# Altium project EMI_Probe.PrjPcb
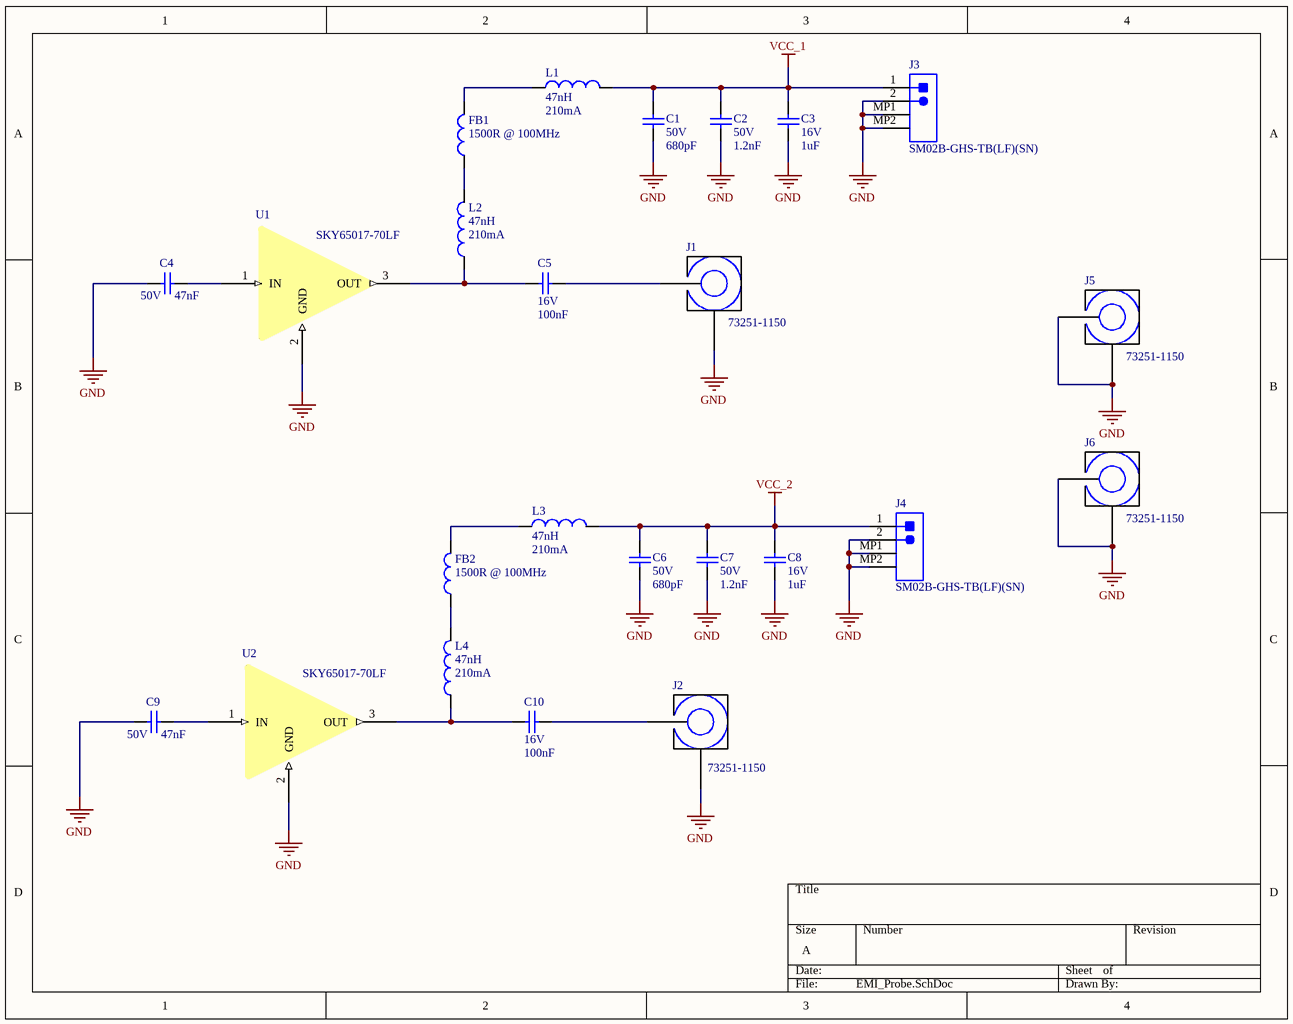
[diagram p0: EMI_Probe.SchDoc]
1 sheet, 24 parts. Net scope: global (net labels, ports and power ports of the same name join across sheets).
Board file: PCB1.PcbDoc

## Sheet EMI_Probe.SchDoc
size A

### Parts
C1  Voltage: 50V  [C0402[1005]]  (hidden comment: 680pF)
C2  Voltage: 50V  [C0603[1608]]  (hidden comment: 1.2nF)
C3  Voltage: 16V  [C0402[1005]]  (hidden comment: 1uF)
C4  Voltage: 50V  [C0402[1005]]  (hidden comment: 47nF)
C5  Voltage: 16V  [C0402[1005]]  (hidden comment: 100nF)
C6  Voltage: 50V  [C0402[1005]]  (hidden comment: 680pF)
C7  Voltage: 50V  [C0603[1608]]  (hidden comment: 1.2nF)
C8  Voltage: 16V  [C0402[1005]]  (hidden comment: 1uF)
C9  Voltage: 50V  [C0402[1005]]  (hidden comment: 47nF)
C10  Voltage: 16V  [C0402[1005]]  (hidden comment: 100nF)
FB1  1500R @ 100MHz  [R0805[2012]]
FB2  1500R @ 100MHz  [R0805[2012]]
J1  73251-1150  [732511040]
J2  73251-1150  [732511040]
J3  SM02B-GHS-TB(LF)(SN)  [SM02B-GHS-TB]
J4  SM02B-GHS-TB(LF)(SN)  [SM02B-GHS-TB]
J5  73251-1150  [732511040]
J6  73251-1150  [732511040]
L1  47nH  Current Rating: 210mA  [C0402[1005]]
L2  47nH  Current Rating: 210mA  [C0402[1005]]
L3  47nH  Current Rating: 210mA  [C0402[1005]]
L4  47nH  Current Rating: 210mA  [C0402[1005]]
U1  SKY65017-70LF  [SOT-89]
U2  SKY65017-70LF  [SOT-89]

### Nets
GND: C1.1 C2.1 C3.1 C4.2 C6.1 C7.1 C8.1 C9.2 J1.2 J2.2 J3.2 J3.MP1 J3.MP2 J4.2 J4.MP1 J4.MP2 J5.1 J5.2 J6.1 J6.2 U1.2(GND) U2.2(GND)
VCC_1: C1.2 C2.2 C3.2 J3.1 L1.2
VCC_2: C6.2 C7.2 C8.2 J4.1 L3.2
NetC4_1: C4.1 U1.1(IN)
NetC5_1: C5.1 J1.1
NetC5_2: C5.2 L2.1 U1.3(OUT)
NetC9_1: C9.1 U2.1(IN)
NetC10_1: C10.1 J2.1
NetC10_2: C10.2 L4.1 U2.3(OUT)
NetFB1_1: FB1.1 L2.2
NetFB1_2: FB1.2 L1.1
NetFB2_1: FB2.1 L4.2
NetFB2_2: FB2.2 L3.1

### Library data of the parts
C1 C6 = C680pF 50V 0402: 680pF 50V X7R 10% 0402; Manufacturer: Yageo; Manufacturer Part Number: CC0402KRX7R9BB681; Internal Code: 0-ECCAP680pX7RV50%10P0402-YG; Type: Capacitor; Package: 0402; Supplier1: DigiKey; Supplier Part Number1: 311-1030-2-ND; Supplier Link1: https://www.digikey.fr/product-detail/fr/yageo/CC0402KRX7R9BB681/311-1030-2-ND/302764; Datasheet: http://www.yageo.com/documents/recent/UPY-GPHC_X7R_6.3V-to-50V_18.pdf; Tolerance: 10%; Temp Coef: X7R; Value: 680pF
C2 C7 = C1.2nF 50V 0603: 1.2nF 50V C0G,NP0 5% 0603; Manufacturer: Walsin; Manufacturer Part Number: 0603N122J500CT; Internal Code: 0-ECCAP1n2NP0V50%05P0603-WS; Temp Coef: C0G NP0; Type: Capacitor; Package: 0603; Supplier1: DigiKey; Supplier Part Number1: 1292-1482-6-ND; Supplier Link1: https://www.digikey.fr/product-detail/fr/walsin-technology-corporation/0603N122J500CT/1292-1482-6-ND/9356021; Datasheet: http://www.passivecomponent.com/wp-content/uploads/2018/10/MLCC.pdf; Tolerance: 5%; Value: 1.2nF
C3 C8 = C1uF 16V 0402: 1uF 16V X5R 10% 0402; Manufacturer: Samsung Electro-Mechanics; Manufacturer Part Number: CL05A105KO5NNNC; Internal Code: 0-ECCAP1uX5RV16%10P0402-; Type: Capacitor; Package: 0402; Supplier1: DigiKey; Supplier Part Number1: 1276-1067-2-ND; Supplier Link1: https://www.digikey.fr/product-detail/fr/samsung-electro-mechanics/CL05A105KO5NNNC/1276-1067-2-ND/3886725; Datasheet: http://www.samsungsem.com/kr/support/product-search/mlcc/CL05A105KO5NNNC.jsp; Tolerance: 10%; Temp Coef: X5R; Value: 1uF
C4 C9 = C47nF 50V 0402: 47nF 50V X7R 10% 0402; Manufacturer: Yageo; Manufacturer Part Number: CC0402KRX7R9BB473; Internal Code: 0-ECCAP47nX7RV50%10P0402-YG; Type: Capacitor; Package: 0402; Supplier1: DigiKey; Supplier Part Number1: 311-3815-1-ND; Supplier Link1: https://www.digikey.fr/products/fr?keywords=311-3815-1-ND; Datasheet: http://www.yageo.com/documents/recent/UPY-GPHC_X7R_6.3V-to-50V_18.pdf; Tolerance: 10%; Temp Coef: X7R; Value: 47nF
C5 C10 = C100nF 16V 0402: 100nF 16V X7R 10% 0402; Manufacturer: Kemet; Manufacturer Part Number: C0402C104K4RACTU; Internal Code: 0-ECCAP100nX7RV16%10P0402-; Type: Capacitor; Package: 0402; Supplier1: DigiKey; Supplier Part Number1: 399-3521-1-ND; Supplier Link1: https://www.digikey.fr/products/fr?keywords=399-3521-1-ND; Datasheet: https://api.kemet.com/component-edge/download/datasheet/C0402C104K4RACTU.pdf; Tolerance: 10%; Temp Coef: X7R; RoHS Compliant: Yes; Value: 100nF
FB1 FB2 = Ferrite bead 1.5 KOHM 0805 1LN: 1,5 kOhms @ 100MHz 1 Ligne de signal Ferrite Bead 0805 (2012 métrique) 1A 300mOhms; Manufacturer: Wurth Electronics Inc.; Manufacturer Part Number: 742792097; Impedance: 1500 Ohms @100MHz; Supplier1: Digikey; Supplier Link1: https://www.digikey.fr/product-detail/fr/w-rth-elektronik/742792097/732-4649-1-ND/4310380; Supplier Part Number1: 732-4649-1-ND; Package: 0805; Datasheet: https://www.we-online.de/katalog/datasheet/742792097.pdf; Internal Code: *; Courant Nominal: 1A; Type: Ferrite
J1 J2 J5 J6 = SMA RA 50ohm: Manufacturer: Molex; Frequency: max : 6GHz; Manufacturer Part Number: 73251-1150; Manufacturer Part Description: 73251-1150; RoHS: Yes; Supplier1: Farnell; Supplier2: *; Supplier Part Number1: 1909295; Temperature Range: -40°C to +90°C; Supplier Link2: *; Internal Code: *; Type: Connector
J3 J4 = SM02B-GHS-TB(LF)(SN): Connector Header Surface Mount, Right Angle 2 position 0.049" (1.25mm); Manufacturer: JST; Manufacturer Part Number: SM02B-GHS-TB(LF)(SN); Supplier1: Digikey; Supplier Part Number1: 455-1564-2-ND; Supplier Link1: https://www.digikey.com/product-detail/en/jst-sales-america-inc/SM02B-GHS-TB-LF-SN/455-1564-2-ND/807786; Datasheet: http://www.jst-mfg.com/product/pdf/eng/eGH.pdf; Type: Connector
L1-L4 = L47nH 210mA 1Ohm 0402: 47nH 210mA 5% 1Ohm; Manufacturer Part Number: LQW15AN47NJ00D; Manufacturer: Murata Electronics North America; Package Metric: 1x0.5x0.6mm; DC Resistance: 1.08Ohm max; Internal Code: 00-ECL47nA210m%05P0402-; Type: Inductor; Package: 0402; Supplier Link1: https://www.digikey.fr/product-detail/en/murata-electronics-north-america/LQW15AN47NJ00D/490-1154-2-ND/584363; Supplier1: Digikey; Supplier Part Number1: 490-1154-2-ND; Datasheet: https://search.murata.co.jp/Ceramy/image/img/P02/JELF243A-0050.pdf; Tolerance: 5%; Value: 47nH
U1 U2 = SKY65017-70LF: Amplificateur RF .1-6.0GHz InGaP HBT Sm Sig Gain 20dB; Manufacturer: Skyworks; Manufacturer Part Number: SKY65017-70LF; Supplier1: Digikey; Supplier Part Number1: 873-SKY65017-70LF; Supplier Link1: https://www.mouser.fr/ProductDetail/?qs=WMHGlxXAKT99sCQ%252BRQ%252BbPg%3D%3D; Internal Code: *; Datasheet: https://www.mouser.fr/datasheet/2/472/SKY65017_70LF_200528I-1524673.pdf